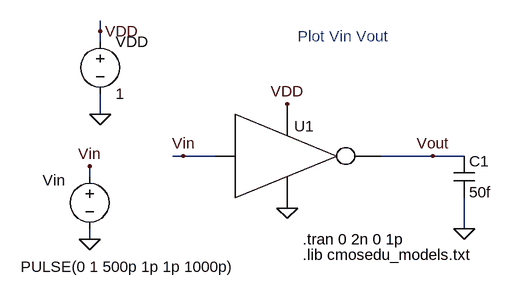
[diagram p0: schematic Fig11_11_symbol.asc]
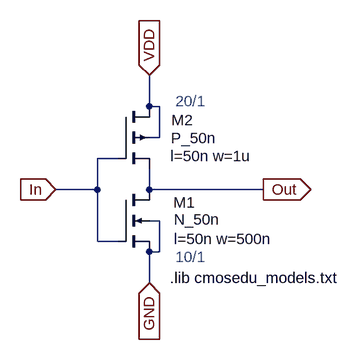
[diagram p1: sub-circuit inv_20_10.asc]
Fig11_11_symbol.asc, the LTspice schematic file:
Version 4
SHEET 1 1136 680
WIRE 176 -144 176 -160
WIRE 176 -48 176 -64
WIRE 192 -368 192 -384
WIRE 192 -352 192 -368
WIRE 192 -240 192 -272
WIRE 320 -176 304 -176
WIRE 368 -176 320 -176
WIRE 704 -176 624 -176
WIRE 752 -176 704 -176
WIRE 752 -64 752 -112
FLAG 176 -48 0
FLAG 704 -176 Vout
FLAG 176 -160 Vin
FLAG 192 -240 0
FLAG 192 -368 VDD
FLAG 320 -176 Vin
FLAG 752 -64 0
FLAG 480 -256 VDD
FLAG 480 -96 0
SYMBOL voltage 176 -160 R0
WINDOW 0 -72 21 Left 0
WINDOW 3 -106 154 Left 0
WINDOW 123 0 0 Left 0
WINDOW 39 0 0 Left 0
SYMATTR InstName Vin
SYMATTR Value PULSE(0 1 500p 1p 1p 1000p)
SYMBOL voltage 192 -368 R0
WINDOW 123 0 0 Left 0
WINDOW 39 0 0 Left 0
SYMATTR InstName VDD
SYMATTR Value 1
SYMBOL cap 736 -176 R0
SYMATTR InstName C1
SYMATTR Value 50f
SYMBOL INV_20_10 400 -240 R0
SYMATTR InstName U1
TEXT 504 -48 Left 0 !.tran 0 2n 0 1p
TEXT 496 -360 Left 0 ;Plot Vin Vout
TEXT 504 -24 Left 0 !.lib cmosedu_models.txt

inv_20_10.asc, the sub-circuit schematic file:
Version 4
SHEET 1 1136 680
WIRE 368 -176 304 -176
WIRE 368 -176 368 -224
WIRE 368 -96 368 -176
WIRE 400 -224 368 -224
WIRE 400 -96 368 -96
WIRE 448 -304 448 -352
WIRE 448 -176 448 -208
WIRE 448 -32 448 -80
WIRE 464 -304 448 -304
WIRE 464 -256 448 -256
WIRE 464 -256 464 -304
WIRE 464 -128 448 -128
WIRE 464 -80 448 -80
WIRE 464 -80 464 -128
WIRE 624 -176 448 -176
FLAG 304 -176 In
IOPIN 304 -176 In
FLAG 448 -352 VDD
IOPIN 448 -352 In
FLAG 448 -32 GND
IOPIN 448 -32 In
FLAG 624 -176 Out
IOPIN 624 -176 Out
SYMBOL nmos4 400 -176 R0
WINDOW 0 119 20 Right 0
WINDOW 3 157 46 Right 0
WINDOW 123 238 76 Right 0
SYMATTR InstName M1
SYMATTR Value N_50n
SYMATTR Value2 l=50n w=500n
SYMBOL pmos4 400 -304 R0
WINDOW 0 116 21 Right 0
WINDOW 3 151 49 Right 0
WINDOW 123 206 76 Right 0
SYMATTR InstName M2
SYMATTR Value P_50n
SYMATTR Value2 l=50n w=1u
TEXT 488 -312 Left 0 ;20/1
TEXT 488 -72 Left 0 ;10/1
TEXT 480 -40 Left 0 !.lib cmosedu_models.txt

The netlist it stands for:
* Fig11_11_symbol.asc
Vin Vin 0 PULSE(0 1 500p 1p 1p 1000p)
VDD VDD 0 1
C1 Vout 0 50f
XU1 Vin Vout VDD 0 inv_20_10

* block symbol definitions
.subckt inv_20_10 In Out VDD GND
M1 Out In GND GND N_50n l=50n w=500n
M2 VDD In Out VDD P_50n l=50n w=1u
* 20/1
* 10/1
.lib cmosedu_models.txt
.ends inv_20_10

.model NMOS NMOS
.model PMOS PMOS
.lib standard.mos
.tran 0 2n 0 1p
* Plot Vin Vout
.lib cmosedu_models.txt
.backanno
.end